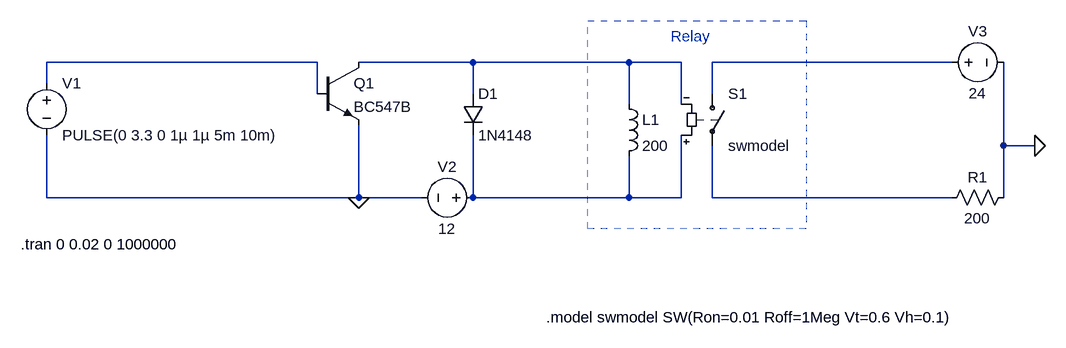
[diagram p0: schematic Schaltverstärker.asc]
Schaltverstärker.asc, the LTspice schematic file:
Version 4
SHEET 1 1732 680
WIRE 608 64 192 64
WIRE 848 64 672 64
WIRE 1088 64 848 64
WIRE 1168 64 1088 64
WIRE 1584 64 1216 64
WIRE 192 96 192 64
WIRE 608 112 608 64
WIRE 848 112 848 64
WIRE 1216 112 1216 64
WIRE 1088 128 1088 64
WIRE 1168 128 1168 64
WIRE 1664 192 1664 64
WIRE 1712 192 1664 192
WIRE 192 272 192 176
WIRE 672 272 672 160
WIRE 672 272 192 272
WIRE 768 272 672 272
WIRE 848 272 848 176
WIRE 1088 272 1088 208
WIRE 1088 272 848 272
WIRE 1168 272 1168 176
WIRE 1168 272 1088 272
WIRE 1216 272 1216 192
WIRE 1584 272 1216 272
WIRE 1664 272 1664 192
FLAG 672 272 0
FLAG 1712 192 0
SYMBOL voltage 192 80 R0
WINDOW 123 0 0 Left 0
WINDOW 39 0 0 Left 0
SYMATTR InstName V1
SYMATTR Value PULSE(0 3.3 0 1µ 1µ 5m 10m)
SYMBOL voltage 864 272 R90
WINDOW 0 -32 56 VBottom 2
WINDOW 3 32 56 VTop 2
WINDOW 123 0 0 Left 0
WINDOW 39 0 0 Left 0
SYMATTR InstName V2
SYMATTR Value 12
SYMBOL diode 832 112 R0
SYMATTR InstName D1
SYMATTR Value 1N4148
SYMBOL npn 608 64 R0
SYMATTR InstName Q1
SYMATTR Value BC547B
SYMBOL sw 1216 96 R0
SYMATTR InstName S1
SYMATTR Value swmodel
SYMBOL ind 1072 112 R0
SYMATTR InstName L1
SYMATTR Value 200
SYMATTR SpiceLine Rser=120
SYMBOL voltage 1568 64 R270
WINDOW 0 32 56 VTop 2
WINDOW 3 -32 56 VBottom 2
WINDOW 123 0 0 Left 0
WINDOW 39 0 0 Left 0
SYMATTR InstName V3
SYMATTR Value 24
SYMBOL res 1680 256 R90
WINDOW 0 0 56 VBottom 2
WINDOW 3 32 56 VTop 2
SYMATTR InstName R1
SYMATTR Value 200
TEXT 1152 24 Left 2 ;Relay
TEXT 152 344 Left 2 !.tran 0 0.02 0 1000000
TEXT 960 456 Left 2 !.model swmodel SW(Ron=0.01 Roff=1Meg Vt=0.6 Vh=0.1)
RECTANGLE Normal 1360 320 1024 0 2

The netlist it stands for:
* Schaltverstärker.asc
V1 N001 0 PULSE(0 3.3 0 1µ 1µ 5m 10m)
V2 N004 0 12
D1 N002 N004 1N4148
Q1 N002 N001 0 0 BC547B
S1 N003 N005 N004 N002 swmodel
L1 N002 N004 200 Rser=120
V3 N003 0 24
R1 0 N005 200
.model D D
.lib standard.dio
.model NPN NPN
.model PNP PNP
.lib standard.bjt
* Relay
.tran 0 0.02 0 1000000
.model swmodel SW(Ron=0.01 Roff=1Meg Vt=0.6 Vh=0.1)
.backanno
.end